# EAGLE design pH_v5_0 (EAGLE 7.5.0)
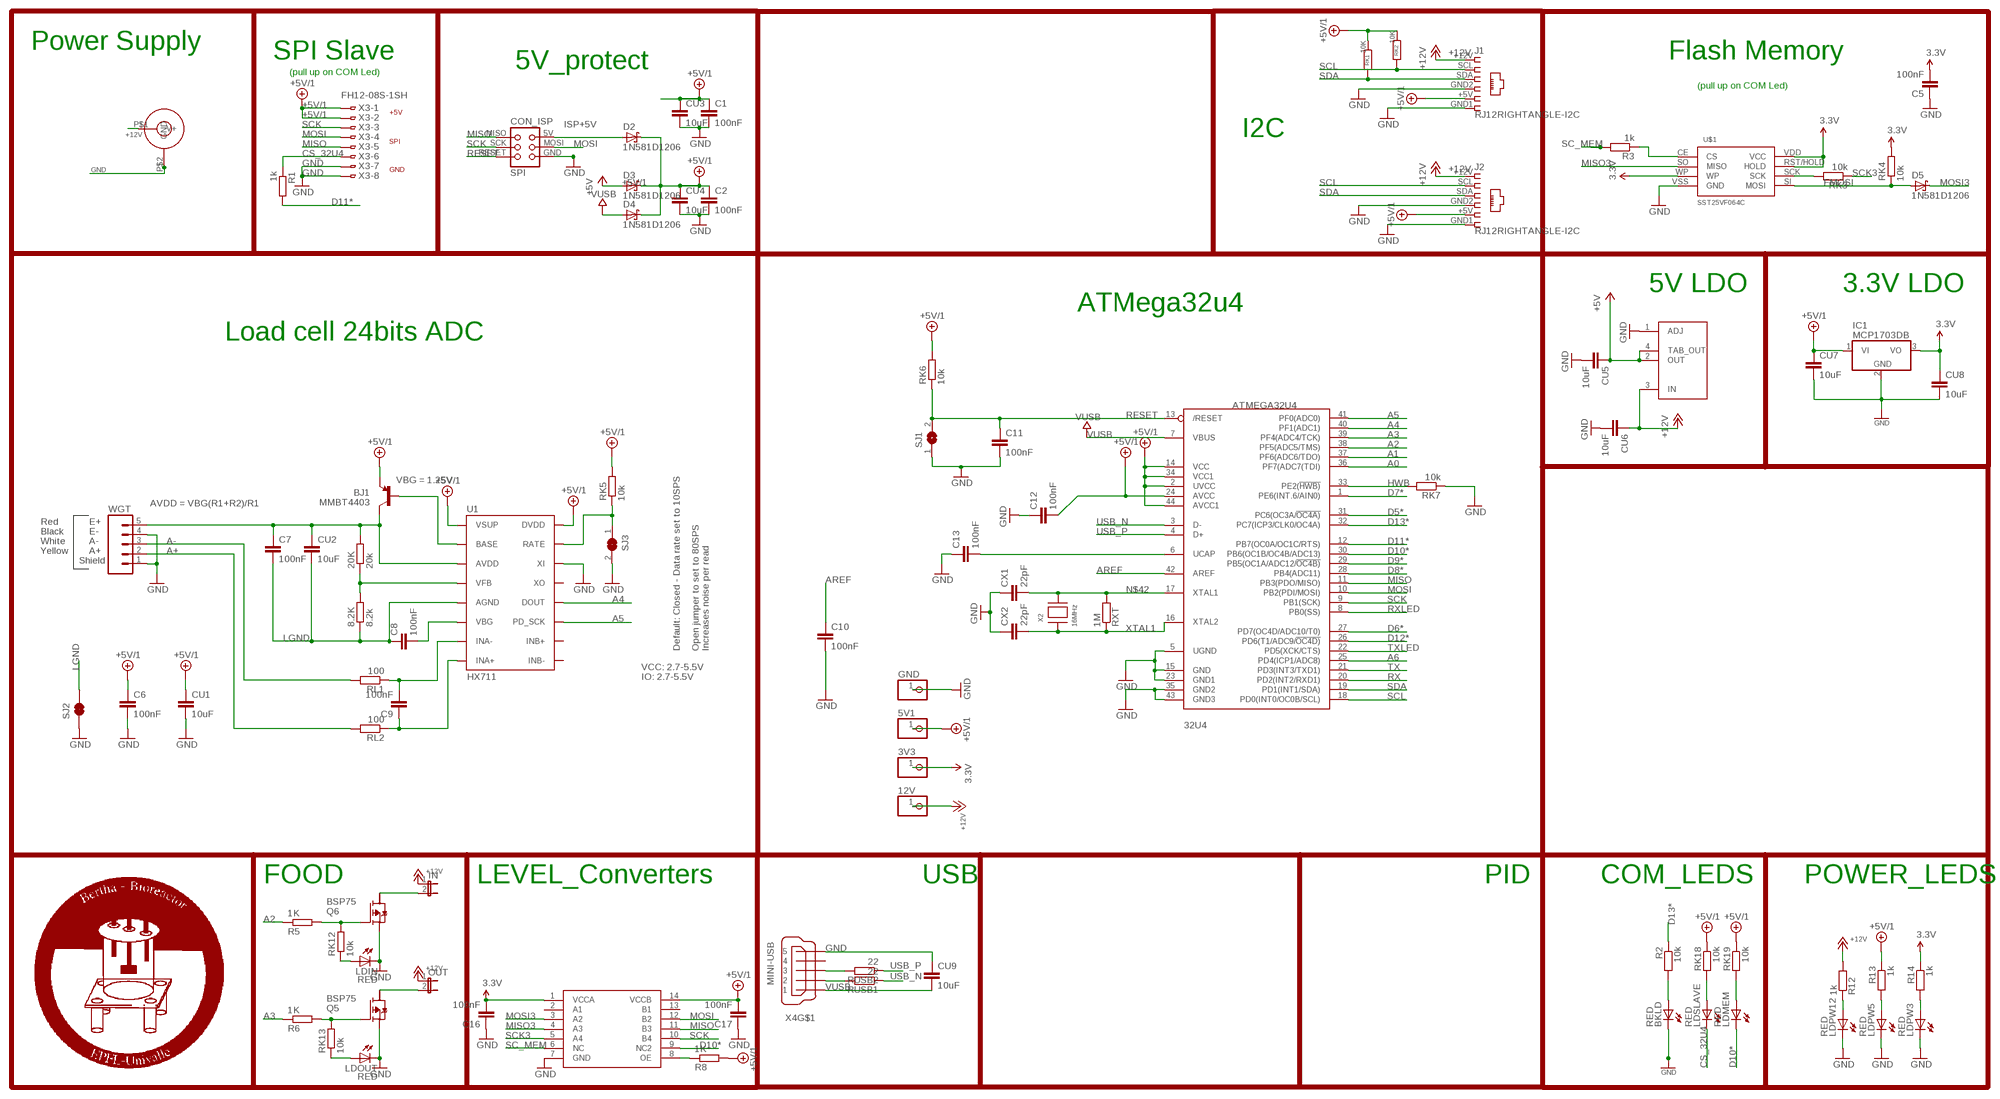
[diagram p0: schematic, sheet 1]

## Parts
3V3  PINHD-1X1  [1X01]
5V1  PINHD-1X1  [1X01]
8.2K  8.2k  R-EU_M0805  [M0805]
12V  PINHD-1X1  [1X01]
20K  20k  R-EU_M0805  [M0805]
32U4  ATMEGA32U4  ATMEGA32U4-AU  [TQFP44]
BJ1  MMBT4403  TRANSISTOR_PNPMMBT4403  [SOT23-3]
BKLD  RED  LEDCHIP-LED0805  [CHIP-LED0805]
C1  100nF  C-EUC1206  [C1206]
C2  100nF  C-EUC1206  [C1206]
C5  100nF  C-EUC1206  [C1206]
C6  100nF  C-EUC1206  [C1206]
C7  100nF  C-EUC1206  [C1206]
C8  100nF  C-EUC1206  [C1206]
C9  100nF  C-EUC1206  [C1206]
C10  100nF  C-EUC1206  [C1206]
C11  100nF  C-EUC1206  [C1206]
C12  100nF  C-EUC1206  [C1206]
C13  100nF  C-EUC1206  [C1206]
C16  100nF  C-EUC1206  [C1206]
C17  100nF  C-EUC1206  [C1206]
CON1  JACK_DC_BARREL  [DC_BARREL]
CON_ISP  SPI  TINYISPT  [TC2030-MCP-NL]
CU1  10uF  C-EUC1206  [C1206]
CU2  10uF  C-EUC1206  [C1206]
CU3  10uF  C-EUC1206  [C1206]
CU4  10uF  C-EUC1206  [C1206]
CU5  10uF  C-EUC1206  [C1206]
CU6  10uF  C-EUC1206  [C1206]
CU7  10uF  C-EUC1206  [C1206]
CU8  10uF  C-EUC1206  [C1206]
CU9  10uF  C-EUC1206  [C1206]
CX1  22pF  C-EUC1206  [C1206]
CX2  22pF  C-EUC1206  [C1206]
D2  1N581D1206  [LED-1206]
D3  1N581D1206  [LED-1206]
D4  1N581D1206  [LED-1206]
D5  1N581D1206  [LED-1206]
GND  PINHD-1X1  [1X01]
IC1  MCP1703DB  [SOT223]
IN  JP1E  [JP1]
J1  RJ12RIGHTANGLE-I2C  [RJ12-RIGHTANGLE-I2C]
J2  RJ12RIGHTANGLE-I2C  [RJ12-RIGHTANGLE-I2C]
LDIN  RED  LEDCHIP-LED0805  [CHIP-LED0805]
LDMEM  RED  LEDCHIP-LED0805  [CHIP-LED0805]
LDOUT  RED  LEDCHIP-LED0805  [CHIP-LED0805]
LDPW3  RED  LEDCHIP-LED0805  [CHIP-LED0805]
LDPW5  RED  LEDCHIP-LED0805  [CHIP-LED0805]
LDPW12  RED  LEDCHIP-LED0805  [CHIP-LED0805]
LDSLAVE  RED  LEDCHIP-LED0805  [CHIP-LED0805]
OUT  JP1E  [JP1]
Q5  BSP75  BSP613P  [PG-SOT-223]
Q6  BSP75  BSP613P  [PG-SOT-223]
R1  1k  R-EU_R0805  [R0805]
R2  10k  R-EU_R0805  [R0805]
R3  1k  R-EU_R0805  [R0805]
R5  1K  R-EU_R0805  [R0805]
R6  1K  R-EU_R0805  [R0805]
R8  1K  R-EU_R0805  [R0805]
R12  1k  R-EU_R0805  [R0805]
R13  1k  R-EU_R0805  [R0805]
R14  1k  R-EU_R0805  [R0805]
RK1  10K  R-EU_M0805  [M0805]
RK2  10K  R-EU_M0805  [M0805]
RK3  10k  R-EU_R0805  [R0805]
RK4  10k  R-EU_R0805  [R0805]
RK5  10k  R-EU_M0805  [M0805]
RK6  10k  R-EU_M0805  [M0805]
RK7  10k  R-EU_M0805  [M0805]
RK12  10k  R-EU_R0805  [R0805]
RK13  10k  R-EU_R0805  [R0805]
RK18  10k  R-EU_R0805  [R0805]
RK19  10k  R-EU_R0805  [R0805]
RL1  100  R-EU_M0805  [M0805]
RL2  100  R-EU_M0805  [M0805]
RUSB1  22  R-EU_M1206  [M1206]
RUSB2  22  R-EU_M1206  [M1206]
RXT  1M  R-EU_R0805  [R0805]
SJ1  SJ  [SJ]
SJ2  JUMPER-PAD-2-NC_BY_TRACE  [PAD-JUMPER-2-NC_BY_TRACE_YES_SILK]
SJ3  SJ  [SJ]
U1  HX711  HX711HX711  [SO16]
U$1  SST25VF064C  [SOIC_8-LEAD]
U$2  NCP1117LPST50T3G  [SOT223]
U$6  TXB0104  [SO14]
WGT  M05PTH  [1X05]
X2  16MHz  XTALNX6035  [NX6035]
X3  FH12-08S-1SH  [FH12-08S-1SH]
X4  MINI-USB  MINI-USB-SCHIELD-32005-201  [32005-201]

## Nets
3.3V [power]: 3V3.1 C5.2 C16.2 CU8.1 IC1.3(VO) R14.1 RK4.2 U$1.RST/HOLD(HOLD) U$1.VDD(VCC) U$1.WP U$6.1(VCCA)
+5V [power]: CU5.1 D3.A U$2.2(OUT) U$2.4(TAB_OUT)
+5V/1 [fine]: 5V1.1 32U4.2(UVCC) 32U4.14(VCC) 32U4.24(AVCC) 32U4.34(VCC1) 32U4.44(AVCC1) BJ1.2(E) C1.1 C2.1 C6.1 C12.2 C17.2 CU1.1 CU3.1 CU4.1 CU7.1 D2.C D3.C D4.C IC1.1(VI) J1.+5V J2.+5V R8.2 R13.1 RK1.1 RK2.1 RK5.2 RK6.2 RK18.1 RK19.1 U1.1(VSUP) U1.16(DVDD) U$6.14(VCCB) X3.1 X3.2
+12V [power]: 12V.1 CON1.P$1(V+) CU6.1 IN.1 J1.+12V J2.+12V OUT.1 R12.2 U$2.3(IN)
A0: 32U4.36(PF7(ADC7(TDI))
A1: 32U4.37(PF6(ADC6/TDO))
A2: 32U4.38(PF5(ADC5/TMS)) R5.1
A3: 32U4.39(PF4(ADC4/TCK)) R6.1
A4: 32U4.40(PF1(ADC1)) U1.12(DOUT)
A5: 32U4.41(PF0(ADC0)) U1.11(PD_SCK)
A6: 32U4.25(PD4(ICP1/ADC8))
A+: RL2.2 WGT.2
A-: RL1.2 WGT.3
AREF: 32U4.42(AREF) C10.1
CN3: C8.2 U1.6(VBG)
CS_32U4: LDSLAVE.C R1.1 X3.6
D5*: 32U4.31(PC6(OC3A/!OC4A))
D6*: 32U4.27(PD7(OC4D/ADC10/T0))
D7*: 32U4.1(PE6(INT.6/AIN0))
D8*: 32U4.28(PB4(ADC11))
D9*: 32U4.29(PB5(OC1A/ADC12/!OC4B))
D10*: 32U4.30(PB6(OC1B/OC4B/ADC13)) LDMEM.C U$6.9(NC2)
D11*: 32U4.12(PB7(OC0A/OC1C/RTS)) R1.2
D12*: 32U4.26(PD6(T1/ADC9/!OC4D))
D13*: 32U4.32(PC7(ICP3/CLK0/OC4A)) R2.1
FMOSI: D5.A RK4.1 U$1.SI(MOSI)
GND [power]: 32U4.5(UGND) 32U4.15(GND) 32U4.23(GND1) 32U4.35(GND2) 32U4.43(GND3) BKLD.C C1.2 C2.2 C5.1 C6.2 C10.2 C11.2 C12.1 C13.1 C16.1 C17.1 CON1.P$2(GND) CON_ISP.GND CU1.2 CU3.2 CU4.2 CU5.2 CU6.2 CU7.2 CU8.2 CU9.1 CX1.1 CX2.1 GND.1 IC1.2(GND) J1.GND1 J1.GND2 J2.GND1 J2.GND2 LDIN.C LDOUT.C LDPW3.C LDPW5.C LDPW12.C Q5.3(S) Q6.3(S) RK7.1 SJ1.1 SJ2.1 SJ3.2 U1.14(XI) U$1.VSS(GND) U$2.1(ADJ) U$6.7(GND) WGT.1 WGT.4 X3.7 X3.8 X4.5
HWB: 32U4.33(PE2(!HWB)) RK7.2
ISP+5V: CON_ISP.5V(VCC) D2.A
LGND: 8.2K.1 C7.2 C8.1 CU2.2 SJ2.2 U1.5(AGND)
MISO: 32U4.11(PB3(PDO/MISO)) CON_ISP.MISO U$6.11(B3) X3.5
MISO3: U$1.SO(MISO) U$6.4(A3)
MOSI: 32U4.10(PB2(PDI/MOSI)) CON_ISP.MOSI U$6.12(B2) X3.4
MOSI3: D5.C U$6.3(A2)
N$1: 32U4.6(UCAP) C13.2
N$3: BKLD.A R2.2
N$4: R8.1 U$6.8(OE)
N$5: 20K.2 BJ1.3(C) C7.1 CU2.1 U1.3(AVDD) WGT.5
N$7: LDPW12.A R12.1
N$8: Q6.1(G) R5.2 RK12.2
N$10: R3.1 U$1.CE(CS)
N$11: Q5.1(G) R6.2 RK13.2
N$12: LDPW5.A R13.2
N$13: OUT.2 Q5.2(D)
N$17: IN.2 Q6.2(D)
N$20: C9.2 RL1.1 U1.7(INA-)
N$22: LDSLAVE.A RK18.2
N$23: RK3.2 U$1.SCK
N$25: LDMEM.A RK19.2
N$27: LDIN.A RK12.1
N$28: LDOUT.A RK13.1
N$34: LDPW3.A R14.2
N$38: BJ1.1(B) U1.2(BASE)
N$39: 8.2K.2 20K.1 U1.4(VFB)
N$41: RK5.1 SJ3.1 U1.15(RATE)
N$42: 32U4.17(XTAL1) CX1.2 RXT.2 X2.P$2
N$43: C9.1 RL2.1 U1.8(INA+)
RESET: 32U4.13(/RESET) C11.1 CON_ISP.RESET RK6.1 SJ1.2
RX: 32U4.20(PD2(INT2/RXD1))
RXLED: 32U4.8(PB0(SS))
SC_MEM: R3.2 U$6.6(NC)
SCK: 32U4.9(PB1(SCK)) CON_ISP.SCK U$6.10(B4) X3.3
SCK3: RK3.1 U$6.5(A4)
SCL: 32U4.18(PD0(INT0/OC0B/SCL)) J1.SCL J2.SCL RK2.2
SDA: 32U4.19(PD1(INT1/SDA)) J1.SDA J2.SDA RK1.2
TX: 32U4.21(PD3(INT3/TXD1))
TXLED: 32U4.22(PD5(XCK/CTS))
USB_N: 32U4.3(D-) RUSB1.1
USB_P: 32U4.4(D+) RUSB2.1
USBC_N: RUSB1.2 X4.2
USBC_P: RUSB2.2 X4.3
VUSB: 32U4.7(VBUS) CU9.2 D4.A X4.1
XTAL1: 32U4.16(XTAL2) CX2.2 RXT.1 X2.P$1
Unconnected: Q5.4(D) Q6.4(D) U1.9(INB-) U1.10(INB+) U1.13(XO) U$6.2(A1) U$6.13(B1) X4.4 X4.M1(S:S1) X4.M2(S:S2) X4.M3(S:S3) X4.M4(S:S4)

## Notes on the sheet
- Power Supply
- SPI Slave | Flash Memory
- 5V_protect
- (pull up on COM Led)
- (pull up on COM Led)
- +5V
- I2C
- SPI
- GND
- 5V LDO | 3.3V LDO
- ATMega32u4
- Load cell 24bits ADC
- VBG = 1.25V
- AVDD = VBG(R1+R2)/R1
- Red | E+
- Black | E-
- White | A-
- Yellow | A+
- Shield
- Default: Closed - Data rate set to 10SPS
- Open jumper to set to 80SPS
  Increases noise per read
- VCC: 2.7-5.5V
- IO: 2.7-5.5V
- FOOD | LEVEL_Converters | USB | PID | COM_LEDS | POWER_LEDS

## Library data of the parts
3V3 5V1 12V GND = Headerlibrary:PINHD-1X1: PIN HEADER
8.2K 20K R13 R14 RK1 RK2 RK5-RK7 RL1 RL2 RUSB1 RUSB2 = resistor:R-EU_: RESISTOR, European symbol
32U4 = adafruit:ATMEGA32U4: http://www.ladyada.net/library/eagle
BJ1 = SparkFun-DiscreteSemi:TRANSISTOR_PNP: Generic PNP BJT Double check pinouts against datasheets- not all devices are the same! MMBT3906 - 40V 200mA SOT-23 (TRANS-08052) MMBT4403 - 40V 600mA SOT-23 (TRANS-09245); PROD_ID: TRANS-09245
BKLD LDIN LDMEM LDOUT LDPW3 LDPW5 LDPW12 LDSLAVE = adafruit:LED: LED OSRAM: - CHIPLED LG R971, LG N971, LY N971, LG Q971, LY Q971, LO R971, LY R971 LH N974, LH R974 LS Q976, LO Q976, LY Q976 LO Q996 - Hyper CHIPLED LW Q18S LB Q993, LB Q99A, LB R99A - SideLED LS A670, LO A670, LY A670, LG A670, LP A670 LB A673, LV A673, LT A673, LW A673 LH A674 LY A675 LS A676, LA A676, LO A676, LY A676, LW A676 LS A679, LY A679, LG A679 - Hyper Micro SIDELED® LS Y876, LA Y876, LO Y876, LY Y876 LT Y87S - SmartLED LW L88C, LW L88S LB L89C, LB L89S, LG L890 LS L89K, LO L89K, LY L89K LS L896, LA L896, LO L896, LY L896 - TOPLED LS T670, LO T670, LY T670, LG T670, LP T670 LSG T670, LSP T670, LSY T670, LOP T670, LYG T670 LG T671, LOG T671, LSG T671 LB T673, LV T673, LT T673, LW T673 LH T674 LS T676, LA T676, LO T676, LY T676, LB T676, LH T676, LSB T676, LW T676 LB T67C, LV T67C, LT T67C, LS T67K, LO T67K, LY T67K, LW E67C LS E67B, LA E67B, LO E67B, LY E67B, LB E67C, LV E67C, LT E67C LW T67C LS T679, LY T679, LG T679 LS T770, LO T770, LY T770, LG T770, LP T770 LB T773, LV T773, LT T773, LW T773 LH T774 LS E675, LA E675, LY E675, LS T675 LS T776, LA T776, LO T776, LY T776, LB T776 LHGB T686 LT T68C, LB T68C - Hyper Mini TOPLED® LB M676 - Mini TOPLED Santana® LG M470 LS M47K, LO M47K, LY M47K Source: http://www.osram.convergy.de/
C1 C2 C5-C13 C16 C17 CU1-CU9 CX1 CX2 = rcl:C-EU: CAPACITOR, European symbol
CON1 = lpatiny:JACK_DC_BARREL
CON_ISP = lpatiny:TINYISP: CONNECTOR
D2-D5 = lpatiny:1N581*: 1.0A SCHOTTKY BARRIER RECTIFIER Source: http://www.diodes.com/datasheets/ds23001.pdf
IC1 = linear:MCP1703: 250 mA, 16V, Low Quiescent Current LDO Regulator Source: http://ww1.microchip.com/downloads/en/DeviceDoc/22049b.pdf
IN OUT = jumper:JP1E: JUMPER
J1 J2 = lpatiny:RJ12: CORCOM Modular RJ Jacks No Shield Source: www.tycoelectronics.com .. ENG_DS_1654001_1099_RJ_L_0507.pdf
Q5 Q6 = infineon:BSP613P: SIPMOS (R) Small-Signal-Transistor P-Channel (2 Drain) Source: http://www.infineon.com/dgdl/BSP613P_Rev2.4.pdf; OC_FARNELL: unknown; OC_NEWARK: unknown
R1-R3 R5 R6 R8 R12 RK3 RK4 RK12 RK13 RK18 RK19 RXT = rcl:R-EU_: RESISTOR, European symbol
SJ1 SJ3 = jumper:SJ: SMD solder JUMPER
SJ2 = SparkFun-Passives:JUMPER-PAD-2-NC_BY_TRACE
U1 = Testing:HX711; PROD_ID: IC-12445
U$1 = BertaLib:SST25VF064C
U$2 = lpatiny:NCP1117LPST50T3G: 5V, 1A LDO regulator
U$6 = lpatiny:TXB0104: TXB0104 4-Bit Bidirectional Voltage-level Translator With Automatic Direction Sensing and ±15-kV ESD Protection
WGT = SparkFun-Connectors:M05: Header 5 Standard 5-pin 0.1" header. Use with straight break away headers (SKU : PRT-00116), right angle break away headers (PRT-00553), swiss pins (PRT-00743), machine pins (PRT-00117), and female headers (PRT-00115). Molex polarized connector foot print use with SKU : PRT-08230 with associated crimp pins and housings.
X2 = lpatiny:XTAL: Low cost SMT crystals, no capacitors included http://www.ladyada.net/library/eagle
X3 = con-hirose:FH12-08S-1S: 1mm Pitch Connectors For FPC/FFC Source: Data sheet <http://www.hirose.co.jp/cataloge_hp/e58605370.pdf>; OC_FARNELL: unknown; OC_NEWARK: unknown
X4 = con-cypressindustries:MINI-USB-SCHIELD-: MINI USB-B Conector Source: www.cypressindustries.com; OC_FARNELL: unknown; OC_NEWARK: unknown

## Net classes
0 default: width 0.203 mm
1 power: width 0.203 mm, drill 0.305 mm, clearance 0.152 mm
2 VIN: width 0.457 mm
3 fine: width 0.254 mm
4 aref: width 0.356 mm

## Board
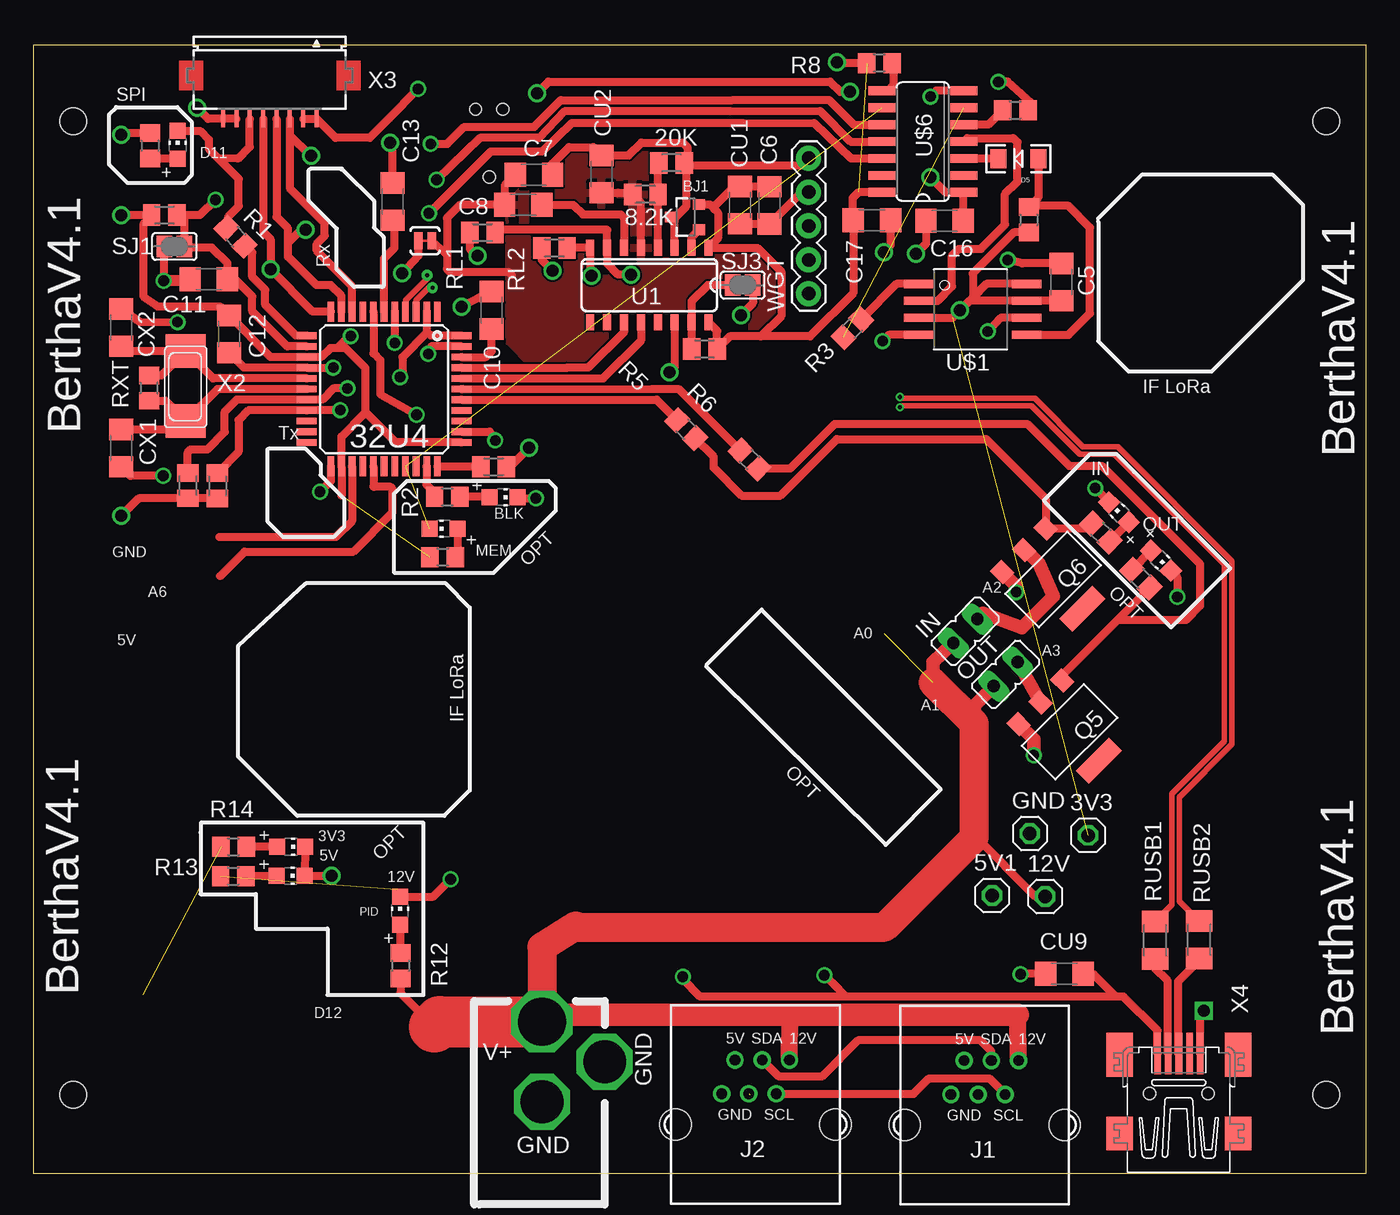
[diagram p1: board, top side]
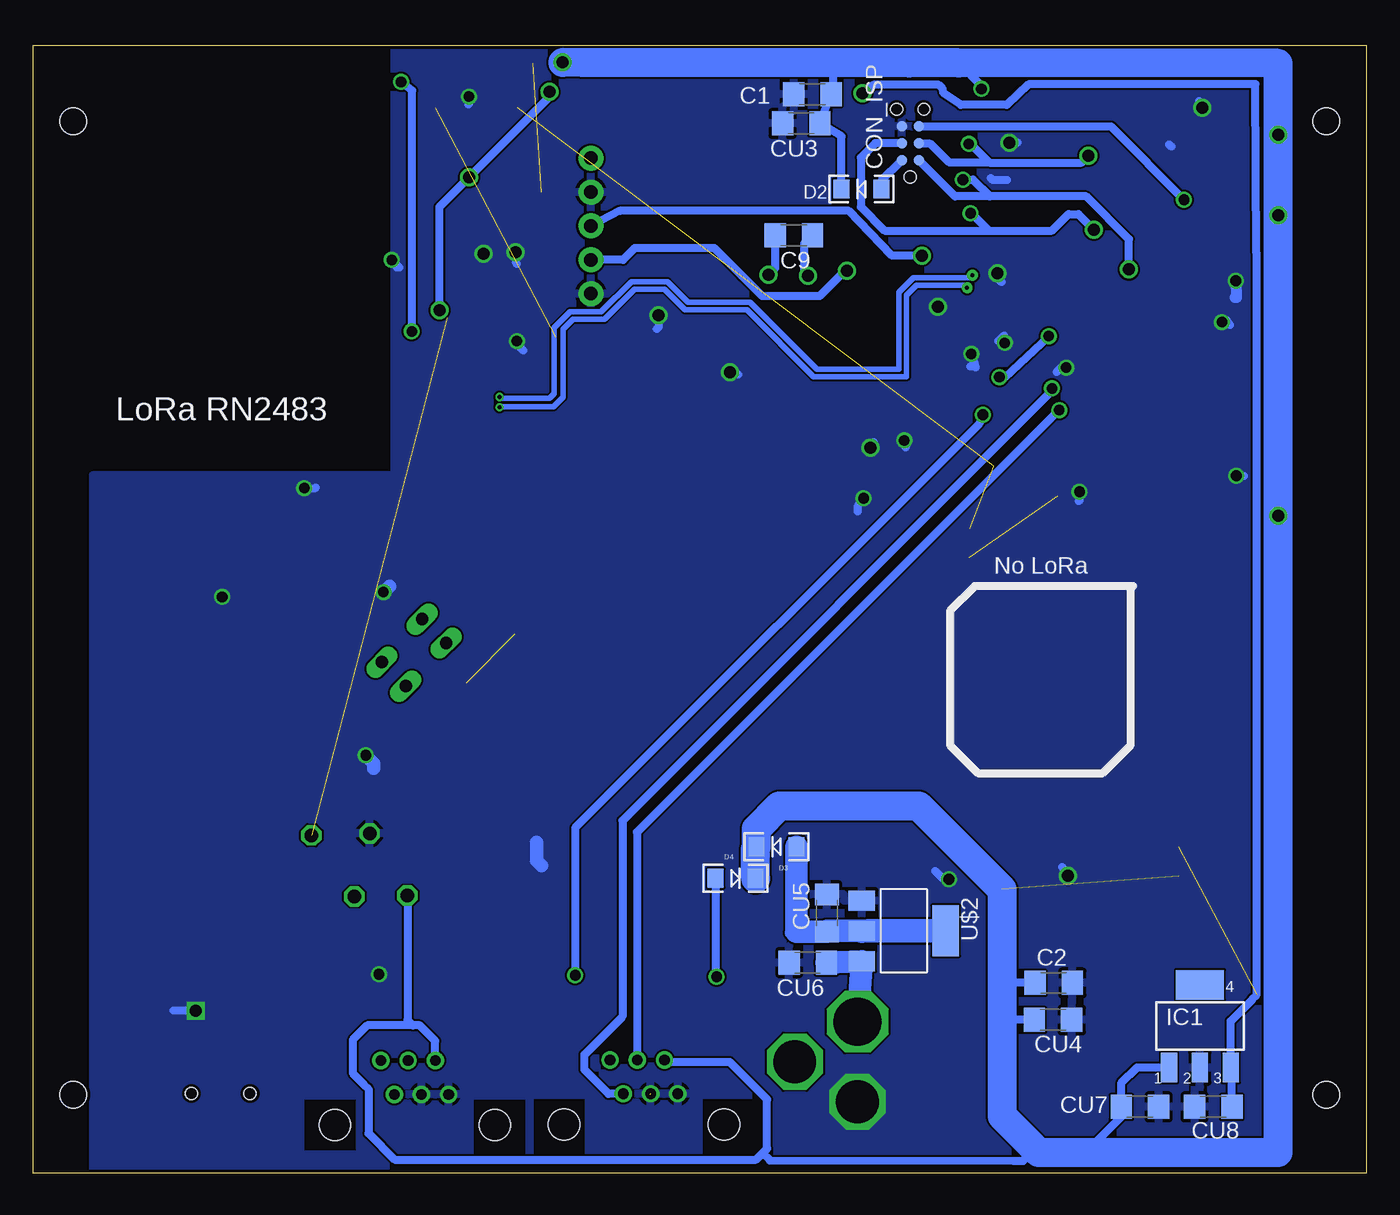
[diagram p2: board, bottom side, seen from below]

Size 100 x 84.6 mm. Coordinates in mm from the lower left corner, seen from the top.
Outline: 0,0 100,0 100,84.6 0,84.6 0,0
Copper layers (1*2*15*16): Top 0.035mm / dielectric 0.2mm / layer 2 0.0175mm / dielectric 1.1mm / layer 15 0.0175mm / dielectric 0.2mm / Bottom 0.035mm
Design rules "SeeedStudio_DRU_no_angle_20130527": minimum track width 6mil, minimum drill 12mil, track to track 6mil, track to pad 6mil, pad to pad 6mil, via to via 6mil, smd to smd 0mil, copper to edge 10mil, drill to drill 10mil, minimum pad ring 6mil, minimum via ring 6mil, stop-mask expansion 2mil, vias tented up to drill 25mil, thermal gap 10mil
Holes 2 mm at 3,78.9 97,78.9 3,5.9 97,5.9
vRestrict: area 13.7,78 to 21.9,81.8

### Footprints (pad centres in the part's own frame; a part is rotated, then mirrored left to right if it is on the bottom)
1X01 = drill 1.016 octagon: 1 0,0
M0805 = smd 1.3 x 1.6: 1 -0.95,0; 2 0.95,0
TQFP44 = smd 1.5 x 0.5: 1 -5.8,4; 2 -5.8,3.2; 3 -5.8,2.4; 4 -5.8,1.6; 5 -5.8,0.8; 6 -5.8,0; 7 -5.8,-0.8; 8 -5.8,-1.6; 9 -5.8,-2.4; 10 -5.8,-3.2; 11 -5.8,-4; 23 5.8,-4; 24 5.8,-3.2; 25 5.8,-2.4; 26 5.8,-1.6; 27 5.8,-0.8; 28 5.8,0; 29 5.8,0.8; 30 5.8,1.6; 31 5.8,2.4; 32 5.8,3.2; 33 5.8,4 | smd 0.5 x 1.5: 12 -4,-5.8; 13 -3.2,-5.8; 14 -2.4,-5.8; 15 -1.6,-5.8; 16 -0.8,-5.8; 17 0,-5.8; 18 0.8,-5.8; 19 1.6,-5.8; 20 2.4,-5.8; 21 3.2,-5.8; 22 4,-5.8; 34 4,5.8; 35 3.2,5.8; 36 2.4,5.8; 37 1.6,5.8; 38 0.8,5.8; 39 0,5.8; 40 -0.8,5.8; 41 -1.6,5.8; 42 -2.4,5.8; 43 -3.2,5.8; 44 -4,5.8
SOT23-3 = smd 0.8 x 0.9: 1 -0.95,-1; 2 0.95,-1; 3 0,1.1
CHIP-LED0805 = smd 1.2 x 1.2: A 0,-1.05; C 0,1.05
C1206 = smd 1.6 x 1.8: 1 -1.4,0; 2 1.4,0
DC_BARREL = drill 3.6 pad 4.5 octagon: P$1 0,13.7 | drill 3.2 pad 4.064 octagon: P$2 0,7.7; P$3 4.7,10.7
TC2030-MCP-NL = smd 0.787 x 0.787: 5V 1.27,0.635; GND 3.81,0.635; MISO 1.27,-0.635; MOSI 2.54,0.635; RESET 3.81,-0.635; SCK 2.54,-0.635 | hole 0.889: 0,0; 5.08,-1.016; 5.08,1.016
LED-1206 = smd 1.2 x 1.4: A -1.5,0; C 1.5,0
SOT223 = smd 1.219 x 2.235: 1 -2.311,-3.099; 2 0,-3.099; 3 2.311,-3.099 | smd 3.6 x 2.2: 4 0,3.099
JP1 = drill 0.914 long: 1 0,-1.27; 2 0,1.27
RJ12-RIGHTANGLE-I2C = drill 0.8 pad 1.3: +5V -1.54,4.84; +12V 2.54,4.84; GND1 -2.54,2.3; GND2 -0.5,2.3; SCL 1.54,2.3; SDA 0.5,4.84 | hole 2.36: -6,0; 6,0
PG-SOT-223 = smd 1.2 x 1.4: 1 -2.311,-3.099; 2 0,-3.099; 3 2.311,-3.099 | smd 3.5 x 1.4: 4 0,3.099
R0805 = smd 1.3 x 1.5: 1 -0.95,0; 2 0.95,0
M1206 = smd 1.6 x 2: 1 -1.4,0; 2 1.4,0
SJ = smd 1.168 x 1.6: 1 -0.762,0; 2 0.762,0
PAD-JUMPER-2-NC_BY_TRACE_YES_SILK = smd 0.635 x 1.27: 1 -0.508,0; 2 0.508,0
SO16 = smd 0.6 x 1.2: 1 -4.445,-2.8; 2 -3.175,-2.8; 3 -1.905,-2.8; 4 -0.635,-2.8; 5 0.635,-2.8; 6 1.905,-2.8; 7 3.175,-2.8; 8 4.445,-2.8; 9 4.445,2.8; 10 3.175,2.8; 11 1.905,2.8; 12 0.635,2.8; 13 -0.635,2.8; 14 -1.905,2.8; 15 -3.175,2.8; 16 -4.445,2.8
SOIC_8-LEAD = smd 0.61 x 2.21: CE -1.905,-2.934; RST/HOLD -0.635,5.156; SCK 0.635,5.156; SI 1.905,5.156; SO -0.635,-2.934; VDD -1.905,5.156; VSS 1.905,-2.934; WP 0.635,-2.934
SOT223' = smd 1.499 x 2.007: 1 -2.261,-3.15; 2 0.025,-3.15; 3 2.311,-3.15 | smd 3.81 x 2.007: 4 0,3.15
SO14 = smd 0.66 x 2.032: 1 -3.81,-3.073; 2 -2.54,-3.073; 3 -1.27,-3.073; 4 0,-3.073; 5 1.27,-3.073; 6 2.54,-3.073; 7 3.81,-3.073; 8 3.81,3.073; 9 2.54,3.073; 10 1.27,3.073; 11 0,3.073; 12 -1.27,3.073; 13 -2.54,3.073; 14 -3.81,3.073
1X05 = drill 1.016 pad 1.88: 1 0,0; 2 2.54,0; 3 5.08,0; 4 7.62,0; 5 10.16,0
NX6035 = smd 2.5 x 3: P$1 2.665,0; P$2 -2.565,0
FH12-08S-1SH = smd 0.3 x 1.3: 1 -3.5,3.25; 2 -2.5,3.25; 3 -1.5,3.25; 4 -0.5,3.25; 5 0.5,3.25; 6 1.5,3.25; 7 2.5,3.25; 8 3.5,3.25
32005-201 = smd 3.1 x 0.5: 1 3,1.6; 2 3,0.8; 3 3,0; 4 3,-0.8; 5 3,-1.6 | smd 2.5 x 2: M1 -3,-4.45; M2 -3,4.45 | smd 3.3 x 2: M3 2.9,4.45; M4 2.9,-4.45 | hole 0.9: 0,2.2; 0,-2.2

### Placement (x,y rotation side)
3V3  79.13,25.34 0 top
5V1  71.93,20.82 0 top
8.2K  45.92,73.41 0 top
12V  75.9,20.75 0 top
20K  47.88,75.77 0 top
32U4  26.31,58.81 270 top
BJ1  48.94,71.71 90 top
BKLD  35.29,50.7 270 top
C1  41.55,80.92 180 bottom
C2  23.45,14.26 0 bottom
C5  77.11,66.84 270 top
C6  55.23,72.58 270 top
C7  37.55,74.88 180 top
C8  36.76,72.63 0 top
C9  42.94,70.36 180 bottom
C10  34.4,64.71 90 top
C11  13.17,67.04 180 top
C12  14.68,62.93 90 top
C13  26.94,72.87 270 top
C16  68.37,71.45 0 top
C17  62.92,71.46 180 top
CON1  38.16,-2.34 0 top
CON_ISP  34.21,74.71 90 bottom
CU1  53.03,72.61 270 top
CU2  42.62,74.94 270 top
CU3  42.39,78.74 180 bottom
CU4  23.49,11.51 0 bottom
CU5  40.46,19.51 90 bottom
CU6  41.89,15.8 180 bottom
CU7  16.97,4.98 0 bottom
CU8  11.47,4.97 180 bottom
CU9  77.35,14.95 0 top
CX1  6.6,54.38 90 top
CX2  6.6,63.42 270 top
D2  37.87,73.81 180 bottom
D3  44.26,24.48 180 bottom
D4  47.3,22.11 0 bottom
D5  73.89,76.08 180 top
GND  74.76,25.48 0 top
IC1  12.47,11.02 0 bottom
IN  69.92,40.66 315 top
J1  71.38,3.61 0 top
J2  54.19,3.66 0 top
LDIN  81.44,49.57 45 top
LDMEM  30.8,48.35 90 top
LDOUT  84.6,45.94 225 top
LDPW3  19.33,24.48 270 top
LDPW5  19.32,22.3 270 top
LDPW12  27.51,19.69 0 top
LDSLAVE  10.83,77.12 0 top
OUT  72.95,37.43 315 top
Q5  77.75,33.11 225 top
Q6  76.51,44.53 225 top
R1  15.17,70.23 315 top
R2  31.05,50.72 0 top
R3  61.45,63.37 225 top
R5  48.98,55.8 315 top
R6  53.73,53.53 315 top
R8  63.48,83.26 180 top
R12  27.55,15.56 270 top
R13  15,22.28 0 top
R14  15.03,24.48 0 top
RK1  13.82,51.55 90 top
RK2  11.6,51.56 90 top
RK3  73.68,79.73 0 top
RK4  74.69,71.5 270 top
RK5  50.36,61.81 0 top
RK6  9.84,71.86 180 top
RK7  34.54,52.98 180 top
RK12  80.09,48.05 135 top
RK13  83.09,44.59 315 top
RK18  8.76,77.06 270 top
RK19  30.71,46.21 0 top
RL1  33.7,70.55 180 top
RL2  39.09,69.39 180 top
RUSB1  84.16,17.47 270 top
RUSB2  87.47,17.5 270 top
RXT  8.68,58.89 270 top
SJ1  10.59,69.5 0 top
SJ2  29.39,69.93 0 top
SJ3  53.22,66.61 0 top
U1  46.22,66.61 180 top
U$1  69.37,64.79 270 top
U$2  NCP1117LPST50T3G  [SOT223']  34.7,18.19 270 bottom
U$6  66.74,77.37 90 top
WGT  58.17,65.96 90 top
X2  11.43,58.99 90 top
X3  17.75,82.33 180 top
X4  85.94,5.98 90 top

### Tracks (layer width: path | path; a pad name or v marks a point on that pad's centre or on a via)
3.3V  (via drill 0.9, 0.9 pad 0.61)  (2 unrouted)
  Top 0.61: C16.2 69.77,73.52 U$6.1 68.44,73.56 v67.31,74.69 | 61.11,81.4 v61.26,81.11 60.55,81.11 59.78,81.87 38.64,81.87 v37.78,81.01 | U$1.WP 68.97,64.15 v69.52,64.7 | U$1.VDD 71.51,66.69 70.49,65.67 | 70.49,65.67 v69.52,64.7 | v69.52,64.7 70.24,65.42 U$1.RST/HOLD 74.54,65.44 C5.2 | RK4.2 73.56,70.55 70.49,67.48 70.49,65.67
  Bottom 0.61: CU8.1 10.07,7.84 IC1.3 10.16,11.4 8.57,12.99 8.57,13.04 8.22,13.39 8.22,68.96 8.24,68.98 8.31,81.67 25.33,81.66 26.96,80.12 30.41,80.12 31.7,81.01 31.77,81.33 32.07,81.63 36.98,81.63 37.59,81.01 v37.78,81.01 | v69.52,64.7 69.52,72.48 v67.31,74.69 61.26,80.73 v61.26,81.11
+5V
  Bottom 1.016: 43.1,18.04 42.75,18.39
  Bottom 1.676: 37.35,18.16 40.46,18.16 CU5.1 42.75,18.11 42.75,18.39 42.75,22.49 42.76,22.49 D3.A
  Bottom 1.778: U$2.2 37.35,18.16 U$2.4
+5V/1  (via drill 0.8 pad 0.81, 0.9 pad 0.61)  (3 unrouted)
  Top 0.61: v28.86,81.32 26.7,79.11 25.25,77.65 22.67,77.65 X3.1 X3.2 | RK1.1 RK2.1 7.91,50.61 v6.6,49.3 | 24.93,57.06 23.11,55.24 32U4.24 23.11,50.81 | 24.93,57.06 24.93,60.39 23.44,61.88 22.81,61.88 | 22.81,61.88 22.3,61.88 21.58,61.21 20.53,61.21 32U4.14 17.8,61.21 C12.2 14.01,65 9.31,65 8.29,65.7 8.29,71.26 8.85,71.83 | 32U4.34 27.18,54.81 24.93,57.06 | 32U4.44 29.83,62.81 29.52,63.12 | 32U4.2 29.52,63.12 | 29.52,63.12 29.52,63.02 27.7,61.2 27.7,59.89 v27.52,59.71 | v23.81,62.78 23.81,62.88 22.81,61.88 | U1.16 51.31,63.16 RK5.2 52.26,62.76 54.59,62.76 | BJ1.2 50.75,72.66 51,72.42 | 51,72.42 51.36,72.05 51.36,70.1 U1.1 54.32,69.41 56.11,67.62 56.11,64.29 54.59,62.76 | C6.1 53.06,73.98 CU1.1 52.59,74.01 51,72.42 | 54.59,62.76 58.28,62.76 61.52,66 C17.2 61.47,71.51 61.47,73.13 61.9,73.56 U$6.14 | RK6.2 8.85,71.83 | 8.85,71.83 v6.6,71.83 | R8.2 60.35,83.26 v60.28,83.3 | RK18.1 6.74,78.01 v6.6,77.87
  Bottom 0.61: v28.86,81.32 28.78,81.49 30.56,83.28 | J1.+5V 69.84,9.92 71.01,11.09 71.53,11.09 | 71.53,11.09 74.95,11.09 76.04,9.99 76.04,7.5 75.17,6.62 | 75.17,6.62 | 75.17,6.62 74.86,6.31 74.86,2.99 72.89,1.02 45.78,1.02 45.29,1.5 | 45.29,1.5 44.95,1.85 44.95,5.53 47.75,8.33 52.48,8.33 J2.+5V | 44.74,0.95 26.47,0.92 25.74,0.92 24.84,1.82 | 44.74,0.95 | 44.74,0.95 45.29,1.5 | D2.C 39.37,77.77 CU3.1 C1.1 39.95,80.92 39.95,83.29 | CU4.1 27.08,11.51 27.32,11.26 | C2.1 27.04,14.26 27.32,13.98 | v27.52,59.71 27.11,59.71 v23.81,62.78 | IC1.1 17.2,7.93 18.39,6.73 18.39,5 CU7.1 18.37,4.21 21.02,1.57 | 6.6,48.11 6.62,48.11 6.85,47.87 | 6.6,82.53 6.6,82.87 6.96,83.23 | v60.28,83.3 58.77,83.26 58.83,83.29 | 5V1.1 71.93,11.48 71.53,11.09
  Bottom 2.184: D4.C 45.8,24.44 D3.C 45.76,25.81 44.03,27.54 33.58,27.54 27.32,21.28 27.32,13.98 27.32,11.26 27.32,4.3 24.84,1.82 24.59,1.57 21.02,1.57 6.6,1.57 6.6,48.11 v6.6,49.3 v6.6,71.83 v6.6,77.87 6.6,82.53 6.6,83.23 6.96,83.23 30.56,83.28 34.29,83.28 39.95,83.29 58.83,83.29 v60.28,83.3
+12V  (1 unrouted)
  Top 0.61: R12.2 27.55,13.51 30.1,10.95 | 12V.1 75.19,20.75 70.59,25.35
  Top 1.016: IN.1 67.51,38.33 67.51,36.8 | 70.59,30.43 70.59,29.5 | OUT.1 70.59,35.07 70.59,33.01
  Top 1.27: J2.+12V 56.78,11.89 | J1.+12V 73.88,11.89
  Top 1.676: 73.88,11.89 56.78,11.89 38.8,11.89 38.8,11.64 38.69,11.64 38.16,11.64 CON1.P$1
  Top 2.184: 38.69,11.64 38.16,12.17 38.16,16.97 40.69,18.56 40.8,18.45 63.88,18.45 70.59,25.16 70.59,25.35 70.59,29.5 70.59,33.01 70.59,33.72 67.51,36.8
  Top 3.81: 30.1,10.95 30.51,11.36 CON1.P$1
  Bottom 1.676: CON1.P$1 U$2.3 CU6.1
A2
  Top 0.61: R5.1 46.77,58.01 32U4.38
A3
  Top 0.61: 32U4.39 32.19,58.81 46.44,58.83 48.4,58.83 53.03,54.2 R6.1
A4
  Top 0.61: 32U4.40 42.76,59.61 45.58,62.43 U1.12
A5
  Top 0.61: 32U4.41 40.06,60.41 40.11,60.42 41.62,60.42 44.31,63.06 U1.11
A6
  Top 0.61: 32U4.25 23.91,48.91 22.7,47.7 13.95,47.7
A+  (via drill 0.9 pad 0.81)
  Top 0.61: RL2.2 38.14,68.5 v38.95,67.69
  Bottom 0.61: v38.95,67.69 39.09,67.69 41.01,65.78 45.31,65.78 46.83,67.3 | 46.83,67.3 | 46.83,67.3 48.9,69.37 54.88,69.37 55.74,68.5 WGT.2
A-  (via drill 0.9 pad 0.81)
  Top 0.61: RL1.2 32.75,69.3 v33.32,68.81
  Bottom 0.61: v33.32,68.81 35.58,68.82 38.81,72.18 56.02,72.18 WGT.3
AREF
  Top 0.61: 32U4.42 33.93,61.21 33.94,61.2 34.4,61.65 C10.1
CN3
  Top 0.61: 44.35,69.44 U1.6 44.33,69.43 44.33,71.63 44.06,71.91 41.23,71.91 40.5,72.63 C8.2
CS_32U4
  Top 0.61: 13.87,76.11 15.37,76.09 16.25,76.97 X3.6 | LDSLAVE.C 12.5,78.17 13.16,77.51 13.16,76.83 13.87,76.11 | R1.1 14.64,71.76 15.41,72.53 15.41,74.58 13.87,76.11
D6*
  Top 0.61: 32U4.27 25.52,51.5 25.54,51.47 26.8,51.47 26.95,51.31 26.95,49.55 24.02,46.62 15.84,46.62 14,44.78
D10*  (2 unrouted)
D11*
  Top 0.61: 32U4.12 19.71,62.81 17.4,65.12 17.4,66.25 16.43,67.22 16.43,69.06 R1.2
D13*
  Top 0.61: 32U4.32 29.5,53 29.5,51.64 30.1,51.05 R2.1
FMOSI
  Top 0.61: D5.A 75.39,73.16 RK4.1 74.78,72.54 77.66,72.54 79.28,70.92 79.28,64.49 77.67,62.88 U$1.SI
GND  (via drill 0.8, 0.8 pad 0.41, 0.8 pad 0.81, 0.9, 0.9 pad 0.61, 0.9 pad 0.81)  (1 unrouted)
  Top 0.61: X4.5 87.54,11.92 v87.81,12.19 | v22.5,60.42 22.43,60.39 32U4.15 15.8,60.41 C12.1 | 32U4.5 27.11,62.88 v27.12,62.26 | CX2.1 7.96,63.86 v10.82,63.83 | 32U4.23 22.32,51.91 v21.51,51.1 | v9.74,52.3 7.28,52.3 CX1.1 | 32U4.35 34.24,55.61 v34.66,54.95 | 32U4.43 29.86,62.01 v29.63,61.45 | BKLD.C 36.43,50.61 v37.71,50.61 | CU9.1 74.44,14.95 v74.07,14.92 | C10.2 34.41,66.17 v32.15,64.98 | LDPW3.C LDPW5.C v22.37,22.31 | SJ3.2 53.98,65.26 v53.09,64.36 | CU1.2 55.2,71.21 C6.2 57.63,73.58 WGT.4 | RK7.1 35.76,52.98 v37.18,54.4 | SJ2.1 28.88,68.8 v27.67,67.51 | X3.7 X3.8 13.11,79.08 v12.29,79.89 | SJ1.1 9.78,69.45 v9.78,66.93 | C13.1 26.94,77.09 v26.78,77.26 | C17.1 64.32,69.61 v63.8,69.09 | C16.1 66.97,69.72 v66.22,68.97 | U$1.VSS 64.19,62.88 v63.72,62.41 | U$6.7 67.75,81.18 v67.32,80.75 | LDPW12.C 30,20.74 v31.31,22.05 | C5.1 74.17,68.24 v73.11,68.49 | LDIN.C 80.7,50.35 v79.67,51.38 | LDOUT.C 85.83,44.71 v85.83,43.21 | U1.14 48.12,60.46 v47.74,60.08
  Top 0.813: C11.2 11.62,66.94 v9.78,66.93
  Top 1.016: 53.78,5.87 53.82,5.91 | Q5.3 75.05,32.54 v75.05,31.35 | Q6.3 73.73,44.05 v73.73,43.58
  Bottom 0.61: v87.81,12.19 89.47,12.19 | v22.5,60.42 22.9,60.41 23.23,60.07 | 14.79,77.16 14.61,76.98 | v27.12,62.26 27.18,62.82 27.6,62.4 | v9.74,52.3 9.15,52.3 | v10.82,63.83 10.62,63.85 10.48,63.98 10.22,63.59 | v21.51,51.1 21.51,50.46 21.57,50.4 | 26.93,74.48 28.03,74.48 28.17,74.63 | v34.66,54.95 34.53,54.42 34.62,54.58 | v29.63,61.45 29.3,60.44 29.71,60.49 | v37.71,50.61 38.15,50 38.15,49.62 | v74.07,14.92 73.8,14.96 73.75,15.01 | v22.37,22.31 22.81,22.97 | v53.09,64.36 53.09,63.45 53.23,63.3 53.23,63.32 | v37.18,54.4 37.18,54.57 36.94,54.82 | v27.67,67.51 27.67,67.13 27.35,66.82 | v12.29,79.89 12.29,80.16 12.54,80.41 | v26.78,77.26 26.21,77.26 26.16,77.32 | v63.8,69.09 63.8,68.29 63.72,68.2 | v66.22,68.97 66.22,69.22 66.12,69.32 | v63.72,62.41 63.72,62.17 63.25,61.71 | v67.32,80.75 67.32,80.19 67.37,80.13 | v31.31,22.05 31.73,22.05 32.33,22.65 | v73.11,68.49 72.55,67.94 72.72,67.92 | v79.67,51.38 78.86,51.38 78.82,51.42 | v47.74,60.08 47.32,60.08 47.13,59.89
  Bottom 0.813: v9.78,66.93 9.74,65.66 9.85,65.69
  Bottom 1.016: 62.24,24.81 62.24,23.44 61.87,23.07 | v75.05,31.35 74.45,30.75 74.45,30.38 | v73.73,43.58 73.28,44.03
  pour Bottom: 4.88,85 72.93,85 72.93,52.33 95.55,52.33 95.55,-0.84 4.67,-0.84 4.67,84.96
HWB
  Top 0.61: RK7.2 30.34,52.98 32U4.33
ISP+5V
  Bottom 0.61: D2.A 36.37,74.45 CON_ISP.5V
LGND
  Top 0.61: U1.5 45.58,72.79 8.2K.1 44.84,73.54 CU2.2 | 31.04,68.9 31.04,71.66 32.01,72.63 C8.1 35.36,74.09 C7.2 | 31.04,68.9 31.04,67.81 31.25,67.6 35.66,67.6 35.89,67.37 | SJ2.2 30.89,69.05 31.04,68.9
  pour Top: 56.91,77.59 40.54,77.59 35.69,72.73 35.69,62.38 37.39,60.67 60.36,60.67 63.17,63.49 63.17,74.86 60.66,77.37 58.22,77.35 57.89,77.55 57.34,77.53 57.14,77.55 56.95,77.55
MISO  (via drill 0.8 pad 0.81, 0.9 pad 0.61)
  Top 0.61: v30.25,74.51 33.5,77.66 37.98,77.66 39.89,79.67 52.27,79.67 52.28,79.66 59.02,79.68 61.32,77.37 U$6.11 | 32U4.11 20.97,64.61 v17.8,67.78 17.8,70.06 17.25,70.61 X3.5
  Bottom 0.61: 28.25,73.26 21,73.26 17.8,70.06 v17.8,67.78 | 28.25,73.26 30.85,73.26 CON_ISP.MISO | v30.25,74.51 29.5,74.51 28.25,73.26
MISO3
  Top 0.61: U$6.4 70.07,77.63 73.53,77.63 73.83,77.32 73.83,74.38 72.91,73.45 72.91,71.14 71.1,69.32 69.44,69.32 68.94,68.82 68.94,66.51 67.85,65.42 U$1.SO
MOSI  (via drill 0.8 pad 0.81, 0.9 pad 0.61)
  Top 0.61: v29.68,72 34.31,76.62 38.16,76.62 40.41,78.78 53.06,78.78 53.22,78.78 58.59,78.76 61.35,76.1 U$6.12 | 32U4.10 23.11,65.8 22.31,66.6 21.25,66.6 19.12,68.73 19.12,69.78 | 19.12,69.78 19.12,70.86 18.25,71.73 X3.4 | v20.42,70.78 20.11,70.78 19.12,69.78
  Bottom 0.61: CON_ISP.MOSI 36.83,77.25 37.92,76.16 37.92,72.48 36.13,70.69 28.29,70.69 | 28.29,70.69 23.57,70.69 22.33,71.93 21.58,71.93 v20.42,70.78 | v29.68,72 29.6,72 28.29,70.69
MOSI3
  Top 0.61: D5.C 69.84,76.08 U$6.3
N$1
  Top 0.61: 32U4.6 26.32,68.62 27.1,69.4 27.1,71.32 C13.2
N$3
  Top 0.61: BKLD.A 34.22,50.72 R2.2
N$4
  Top 0.61: U$6.8 64.1,81.14 64.58,81.62 64.58,83.11 R8.1
N$5
  Top 0.61: U1.3 48.12,71.43 BJ1.3 48.19,71.71 48.99,72.52 48.99,75.24 | 48.99,75.24 48.99,75.61 | 48.99,75.61 20K.2 | 48.99,75.61 57.67,75.61 WGT.5 | 48.99,75.24 49.07,75.32 49.07,76.95 48.73,77.29 45.62,77.29 44.66,76.34 CU2.1 41.99,76.96 40.19,76.96 38.95,75.72 C7.1
N$7
  Top 0.61: R12.1 27.55,18.6 LDPW12.A
N$8
  Top 0.61: R5.2 51.05,53.72 51.05,52.9 53.14,50.81 56.05,50.81 60.28,55.05 71.5,55.05 75.95,50.59 Q6.1 79.05,48.35 RK12.2
N$10
  Top 0.61: U$1.CE 64.78,66.69 R3.1
N$11
  Top 0.61: R6.2 56.79,52.86 60.14,56.2 74.57,56.2 77.73,53.04 80.19,53.04 87.54,45.69 87.54,42.54 86.48,41.49 81.33,41.49 | Q5.1 77.19,37.34 81.33,41.49 | 81.33,41.49 RK13.2
N$12
  Top 0.61: LDPW5.A R13.2
N$13
  Top 1.016: Q5.2 OUT.2
N$17
  Top 1.016: IN.2 71.24,41.98 74.17,40.92 76.52,43.27 75.43,45.76 74.47,46.72 Q6.2
N$20  (via drill 0.9 pad 0.81)
  Top 0.61: RL1.1 34.75,70.77 43,70.77 43.04,70.73 U1.7 43.04,68.23 43.88,67.4 v44.83,67.4
  Bottom 0.61: C9.2 44.34,67.89 v44.83,67.4
N$22
  Top 0.61: LDSLAVE.A 8.8,76.07 RK18.2
N$23  (via drill 0.8)
  Top 0.61: U$1.SCK 72.56,64.15 v71.61,63.13 | RK3.2 74.87,80.24 73.1,81.87 v72.4,81.85
  Bottom 0.61: v71.61,63.13 71.57,63.17 71.57,81.22 v72.4,81.85
N$25
  Top 0.61: LDMEM.A 31.84,46.4 RK19.2
N$27
  Top 0.61: RK12.1 80.76,47.4 LDIN.A
N$28
  Top 0.61: RK13.1 82.44,45.26 LDOUT.A
N$34
  Top 0.61: LDPW3.A R14.2
N$38
  Top 0.61: U1.2 49.39,70.21 BJ1.1
N$39
  Top 0.61: U1.4 46.85,70.87 8.2K.2 46.87,75.71 20K.1
N$41
  Top 0.61: RK5.1 49.41,63.79 U1.15 49.39,65.4 50.6,66.61 SJ3.1
N$42
  Top 0.61: 32U4.17 13.82,58.81 X2.P$2 | CX1.2 11.45,55.78 12.04,56.37 11.49,56.37 X2.P$2 | RXT.2 9.92,57.94 X2.P$2
N$43  (via drill 0.9 pad 0.81)
  Top 0.61: RL2.1 40.06,69.41 U1.8 41.77,67.43 v41.89,67.31
  Bottom 0.61: C9.1 42.17,69.73 42.17,67.59 v41.89,67.31
RESET  (via drill 0.8 pad 0.81)
  Top 0.61: 32U4.13 19.05,62.01 16.43,64.63 16.43,65.75 15.13,67.05 14.58,67.05 C11.1 | 14.69,66.92 C11.1 | C11.1 14.56,68.25 13.38,69.43 11.43,69.43 SJ1.2 11.35,71.86 RK6.1 12.49,71.86 v13.67,73.01
  Bottom 0.61: CON_ISP.RESET 19.15,78.52 v13.67,73.01
SC_MEM  (1 unrouted)
SCK  (via drill 0.8 pad 0.81, 0.9 pad 0.61)
  Top 0.61: v29.82,77.2 31.06,77.2 32.33,78.47 37.59,78.47 37.59,78.5 39.57,80.48 52.47,80.48 52.48,80.49 59.7,80.49 61.56,78.64 U$6.10 | 32U4.9 23.91,66.54 21.26,69.19 21.26,69.71 21.87,70.32 21.87,71.25 19.25,73.87 19.25,77.84 | X3.3 19.25,77.84 | v20.84,76.29 20.79,76.29 19.25,77.84
  Bottom 0.61: 28.26,75.79 31.27,75.79 32.68,77.2 33.52,77.2 CON_ISP.SCK | v29.82,77.2 29.68,77.2 28.26,75.79 | 28.26,75.79 21.35,75.79 v20.84,76.29
SCK3
  Top 0.61: RK3.1 71.64,78.64 U$6.5
SCL  (via drill 0.8 pad 0.81)
  Top 0.61: RK2.2 11.6,54.08 11.8,54.29 13.07,54.29 14.37,55.59 14.37,57.11 15.27,58.01 32U4.18 20.53,58.01 21.69,58.01 22.52,58.85 v23.57,58.85 | J2.SCL 66.05,5.96 67.2,7.1 71.73,7.1 J1.SCL
  Bottom 0.61: J2.SCL 56.85,5.96 58.66,7.76 58.66,8.9 55.81,11.74 55.81,26.45 23.57,58.68 v23.57,58.85
SDA  (via drill 0.8 pad 0.81)
  Top 0.61: RK1.2 15.4,54.09 15.4,56.48 16.13,57.21 32U4.19 20.53,57.23 v23.03,57.23 | J1.SDA 71.88,9.15 71.06,9.97 61.89,9.97 59.15,7.23 55.95,7.23 J2.SDA
  Bottom 0.61: v23.03,57.23 23.07,57.23 54.71,25.58 54.71,8.52 J2.SDA
USB_N  (via drill 0.3, 0.3 pad 0.81)
  Top 0.406: 32U4.3 28.71,65.47 29.86,66.61 v29.94,66.4 | v65.03,57.45 65.03,57.55 74.9,57.55 78.52,53.93 81.11,53.93 81.13,53.92 81.19,53.85 89.36,45.68 89.36,32.4 85.41,28.44 85.41,20.12 RUSB1.1
  Bottom 0.406: v29.94,66.4 29.86,66.61 33.73,66.61 34.5,65.83 34.5,59.75 41.45,59.75 46.47,64.77 51.1,64.77 52.65,66.31 54.88,66.31 57.16,64.03 59.51,64.03 60.25,63.29 60.25,58.19 60.97,57.47 65.01,57.47 v65.03,57.45 65.03,57.55
USB_P  (via drill 0.3, 0.3 pad 0.81)
  Top 0.406: 32U4.4 27.91,65.45 29.62,67.17 v29.55,67.35 | v65.03,58.21 65.03,58.11 75.13,58.11 78.75,54.49 80.55,54.49 80.57,54.49 81.36,54.49 89.92,45.91 89.92,32.16 85.97,28.21 85.97,20.41 RUSB2.1
  Bottom 0.406: v29.55,67.35 29.62,67.17 33.96,67.17 35.06,66.06 35.06,60.3 41.22,60.3 46.24,65.33 50.87,65.33 52.41,66.87 55.12,66.87 57.39,64.59 59.74,64.59 60.92,63.41 60.92,58.47 61.28,58.11 65.03,58.11 v65.03,58.21
USBC_N
  Top 0.61: X4.2 85.11,9.01 85.11,14.42 84.16,15.37 RUSB1.2
USBC_P
  Top 0.61: X4.3 85.91,8.97 85.91,14.39 87.47,15.95 RUSB2.2
VUSB  (via drill 0.8, 0.8 pad 0.81)
  Top 0.61: X4.1 84.34,10.71 81.79,13.25 81.21,13.25 | 81.21,13.25 60.98,13.25 | 60.98,13.25 50.04,13.25 48.76,14.53 v48.74,14.73 | CU9.2 79.57,14.89 81.21,13.25 | 32U4.7 25.52,61.49 26.02,60.98 26.02,58.43 v28.76,56.88 | v59.35,14.85 59.93,14.3 60.98,13.25
  Bottom 0.61: v28.76,56.88 29.02,56.23 59.35,25.89 v59.35,14.85 59.34,14.86 | D4.A 48.8,15.22 v48.74,14.73
XTAL1
  Top 0.61: 32U4.16 13.48,59.61 X2.P$1 | X2.P$1 6.97,61.65 CX2.2 | RXT.1 9.62,59.84 X2.P$1

### Text on the board
tNames: SPI | D11 | Rx | IF LoRa | BerthaV4.1 | Tx | BerthaV4.1 | IN | BLK | OUT | GND | MEM | OPT | A2 | OPT | A6 | A0 | 5V | A3 | IF LoRa | A1 | OPT | 3V3 | 5V | OPT | 12V | PID | BerthaV4.1 | D12 | BerthaV4.1
bNames: LoRa RN2483 | No LoRa
tValues: Screen | PID
203bmp: C:/Users/G/Pictures/logo_epfl.bmp